# Altium schematic sheet 7 esc.SchDoc
size A4; DocumentNumber: 7; SheetNumber: 9; SheetTotal: 12
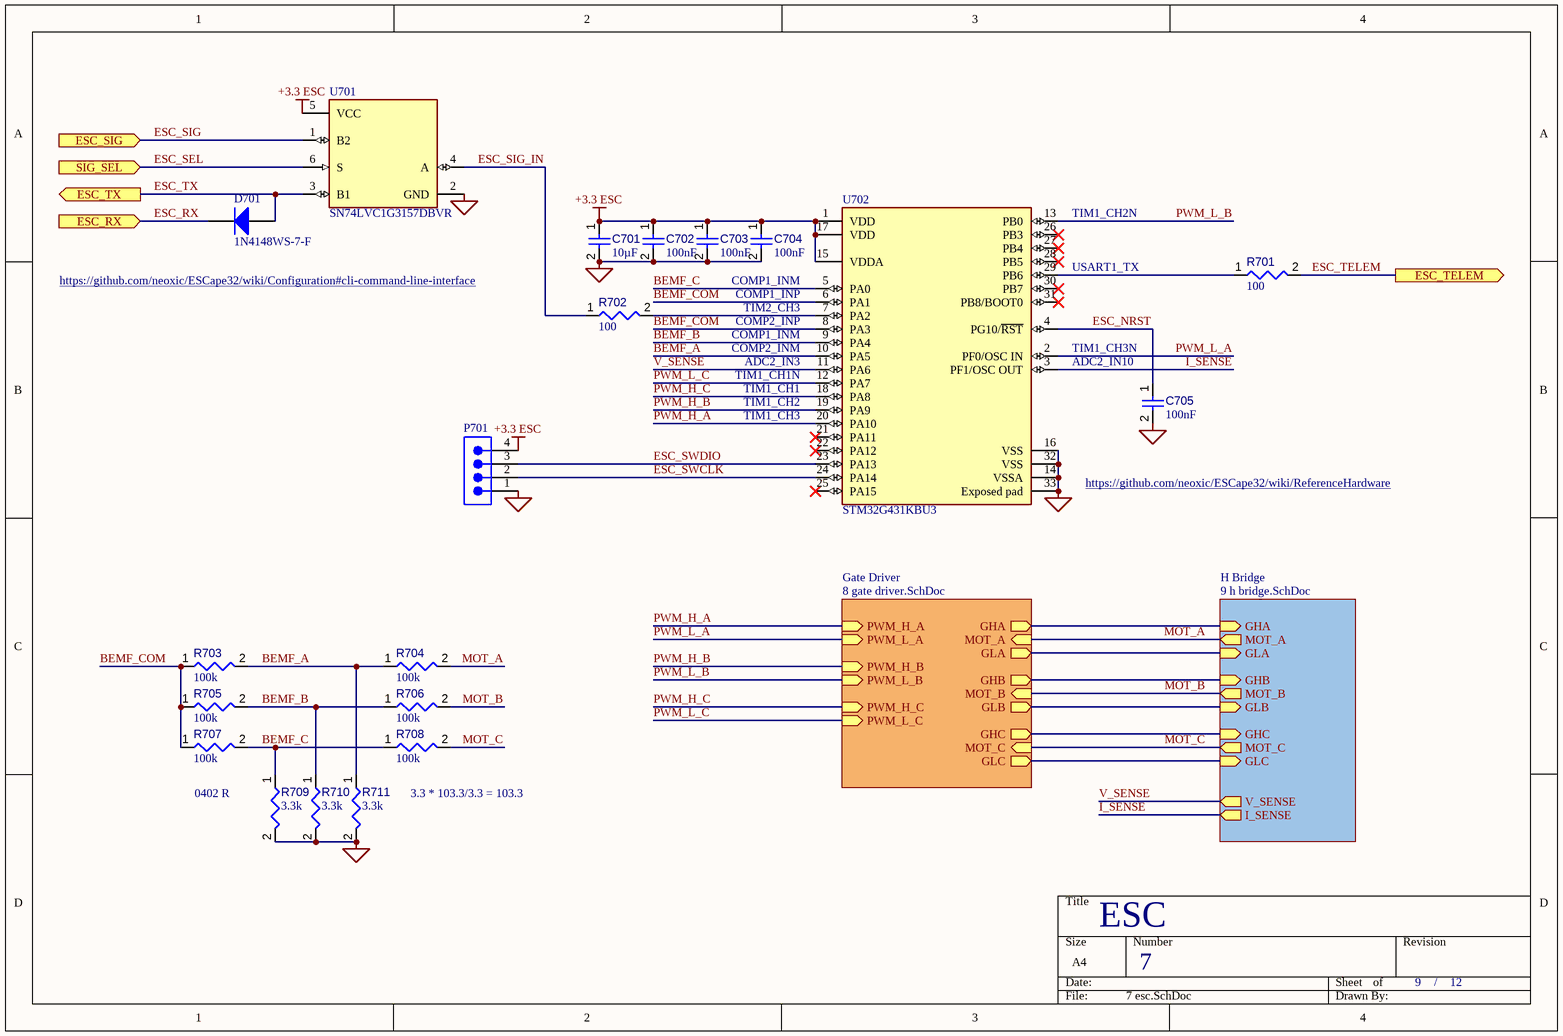
[diagram p0: 7 esc.SchDoc]

## Parts
C701  value 10µF  [CAPC0603(1608)100_L]  (hidden comment: Capacitor 10µF +/-20% 10V 0603)
C702  value 100nF  [CAPC0402(1005)60_L]  (hidden comment: Capacitor 100nF +/-20% 25V 0402)
C703  value 100nF  [CAPC0402(1005)60_L]  (hidden comment: Capacitor 100nF +/-20% 25V 0402)
C704  value 100nF  [CAPC0402(1005)60_L]  (hidden comment: Capacitor 100nF +/-20% 25V 0402)
C705  value 100nF  [CAPC0402(1005)60_L]  (hidden comment: Capacitor 100nF +/-20% 25V 0402)
D701  1N4148WS-7-F  [DIOD-SOD323-2-A_V]
P701  61300411121  [61300411121]  (value not drawn)
R701  value 100  [RESC0402(1005)_L]  (hidden comment: Resistor 100R +/-1 % 0402 63 mW)
R702  value 100  [RESC0402(1005)_L]  (hidden comment: Resistor 100R +/-1 % 0402 63 mW)
R703  value 100k  [RESC0402(1005)_L]  (hidden comment: Resistor 100K +/-1 % 0402 63 mW)
R704  value 100k  [RESC0402(1005)_L]  (hidden comment: Resistor 100K +/-1 % 0402 63 mW)
R705  value 100k  [RESC0402(1005)_L]  (hidden comment: Resistor 100K +/-1 % 0402 63 mW)
R706  value 100k  [RESC0402(1005)_L]  (hidden comment: Resistor 100K +/-1 % 0402 63 mW)
R707  value 100k  [RESC0402(1005)_L]  (hidden comment: Resistor 100K +/-1 % 0402 63 mW)
R708  value 100k  [RESC0402(1005)_L]  (hidden comment: Resistor 100K +/-1 % 0402 63 mW)
R709  value 3.3k  [RESC0402(1005)_L]  (hidden comment: Resistor 3K3 +/-1 % 0402 63 mW)
R710  value 3.3k  [RESC0402(1005)_L]  (hidden comment: Resistor 3K3 +/-1 % 0402 63 mW)
R711  value 3.3k  [RESC0402(1005)_L]  (hidden comment: Resistor 3K3 +/-1 % 0402 63 mW)
U701  SN74LVC1G3157DBVR  [FP-DBV0006A-IPC_C]
U702  STM32G431KBU3  [FP-UFQFPN32-A0B8-MFG]

## Sub-sheets
Gate Driver = 8 gate driver.SchDoc: MOT_A (in), MOT_B (in), MOT_C (in), GHA (out), GLA (out), GHB (out), GLB (out), GHC (out), GLC (out), PWM_H_A (in), PWM_L_A (in), PWM_H_B (in), PWM_H_C (in), PWM_L_B (in), PWM_L_C (in)
H Bridge = 9 h bridge.SchDoc: I_SENSE (out), V_SENSE (out), GHA (in), MOT_A (out), GLA (in), GHB (in), MOT_B (out), GLB (in), GHC (in), MOT_C (out), GLC (in)

## Ports
ESC_RX (in), ESC_SIG (in), ESC_TELEM (out), ESC_TX (out), SIG_SEL (in)

## Nets
+3.3 ESC: C701.1 C702.1 C703.1 C704.1 P701.4 U701.5(VCC) U702.1(VDD) U702.15(VDDA) U702.17(VDD)
PGND: C701.2 C702.2 C703.2 C704.2 C705.2 P701.1 R709.2 R710.2 R711.2 U701.2(GND) U702.14(VSSA) U702.16(VSS) U702.32(VSS) U702.33(Exposed_pad)
BEMF_A: R703.2 R704.1 R711.1 U702.10(PA5)
BEMF_B: R705.2 R706.1 R710.1 U702.9(PA4)
BEMF_C: R707.2 R708.1 R709.1 U702.5(PA0)
BEMF_COM: R703.1 R705.1 R707.1 U702.6(PA1) U702.8(PA3)
ESC_NRST: C705.1 U702.4(PG10/~{RST})
ESC_RX: D701.2(K) ; port ESC_RX
ESC_SEL: U701.6(S) ; port SIG_SEL
ESC_SIG: U701.1(B2) ; port ESC_SIG
ESC_SIG_IN: R702.1 U701.4(A)
ESC_SWCLK: P701.2 U702.24(PA14)
ESC_SWDIO: P701.3 U702.23(PA13)
ESC_TELEM: R701.2 ; port ESC_TELEM
ESC_TX: D701.1(A) U701.3(B1) ; port ESC_TX
I_SENSE: U702.3(PF1/OSC_OUT) ; sheet H Bridge/I_SENSE
MOT_A: R704.2 ; sheet H Bridge/MOT_A, sheet Gate Driver/MOT_A
MOT_B: R706.2 ; sheet H Bridge/MOT_B, sheet Gate Driver/MOT_B
MOT_C: R708.2 ; sheet H Bridge/MOT_C, sheet Gate Driver/MOT_C
PWM_H_A: U702.20(PA10) ; sheet Gate Driver/PWM_H_A
PWM_H_B: U702.19(PA9) ; sheet Gate Driver/PWM_H_B
PWM_H_C: U702.18(PA8) ; sheet Gate Driver/PWM_H_C
PWM_L_A: U702.2(PF0/OSC_IN) ; sheet Gate Driver/PWM_L_A
PWM_L_B: U702.13(PB0) ; sheet Gate Driver/PWM_L_B
PWM_L_C: U702.12(PA7) ; sheet Gate Driver/PWM_L_C
V_SENSE: U702.11(PA6) ; sheet H Bridge/V_SENSE
NetR701_1: R701.1 U702.29(PB6)
NetR702_2: R702.2 U702.7(PA2)
(unnamed): sheet H Bridge/GHA, sheet Gate Driver/GHA
(unnamed): sheet H Bridge/GLA, sheet Gate Driver/GLA
(unnamed): sheet H Bridge/GHB, sheet Gate Driver/GHB
(unnamed): sheet H Bridge/GLB, sheet Gate Driver/GLB
(unnamed): sheet H Bridge/GHC, sheet Gate Driver/GHC
(unnamed): sheet H Bridge/GLC, sheet Gate Driver/GLC

Not connected (* = marked no-connect by the designer): U702 21(PA11)* 22(PA12)* 25(PA15)* 26(PB3)* 27(PB4)* 28(PB5)* 30(PB7)* 31(PB8/BOOT0)*

## Notes on the sheet
- (near U702) TIM1_CH2N
- https://github.com/neoxic/ESCape32/wiki/Configuration#cli-command-line-interface
- COMP1_INM
- COMP1_INP
- TIM2_CH3
- (near U702) USART1_TX
- (near U702) TIM1_CH1N
- (near U702) ADC2_IN3
- (near U702) COMP1_INM
- (near U702) COMP2_INM
- (near U702) COMP2_INP
- TIM1_CH3N
- ADC2_IN10
- (near U702) TIM1_CH1
- (near U702) TIM1_CH2
- (near U702) TIM1_CH3
- https://github.com/neoxic/ESCape32/wiki/ReferenceHardware
- 0402 R
- 3.3 * 103.3/3.3 = 103.3
- ESC
- /

## Library data of the parts
C701 = CMP-001-00075-4: Chip Capacitor, 10µF +/-20%, 10V, 0603, Thickness 1 mm; Tolerance: 10%; Voltage Rating: 10V; Max Operating Temperature: 85°C; Pins: 2; Case/Package: 0603; Mounting Technology: SMT; Min Operating Temperature: -55°C
C702-C705 = CMP-001-00065-4: Chip Capacitor, 100nF +/-20%, 25V, 0402, Thickness 0.6 mm; Tolerance: 10%; Max Operating Temperature: 85°C; Min Operating Temperature: -55°C; Pins: 2; Voltage Rating: 25V; Mounting Technology: SMT; Case/Package: 0402
D701 = CMP-1667-00004-1: Fast Switching Diode, 75 V, 0.3 A, -65 to 150 degC, 2-Pin SOD323, RoHS, Tape and Reel; DatasheetVersion: Rev. 25-2, 03/2016; PackageDescription: 2-Pin Small Outline Diode, Body 1.7 x 1.3 mm; ComponentLink2Description: Datasheet; ComponentLink1URL: http://www.diodes.com/; PackageReference: SOD323-2; ComponentLink2URL: http://www.diodes.com/datasheets/ds30097.pdf; ComponentLink1Description: Manufacturer URL
P701 = CMP-1502-01064-3: NexarPartId: 32855522; Operating Supply Voltage: 250V; Pitch: 2.54mm; Contact Resistance: 20mΩ; Number of Positions: 4; Current Rating: 3A; Connector Type: Male Pin; Gender: Male; Contact Plating: Gold; Height: 8.89mm; Lead Pitch: 2.54mm; Lead Free: Lead Free; Contact Mating Length: 5.9944mm; Number of Rows: 1; Termination: Solder; Packaging: Bulk; REACH SVHC: Unknown; Min Operating Temperature: -40°C; RoHS: Compliant; Number of Contacts: 4; Voltage Rating: 250V; Color: Black; Max Operating Temperature: 105°C; Contact Material: Copper; Mount: Through Hole; Orientation: Vertical; Number of Pins: 4
R701 R702 = CMP-009-00167-3: Chip Resistor, 100 Ohms, +/-1 %, 63 mW, -55 to 155 degC, 0402; Power: 63mW; Tolerance: 1%; Min Operating Temperature: -55°C; Case/Package: 0402; Pins: 2; Max Operating Temperature: 155°C
R703-R708 = CMP-009-00168-3: Chip Resistor, 100 kOhms, +/-1 %, 63 mW, -55 to 155 degC, 0402; Tolerance: 1%; Power: 63mW; Max Operating Temperature: 155°C; Min Operating Temperature: -55°C; Pins: 2; Case/Package: 0402
R709-R711 = CMP-009-00145-3: Chip Resistor, 3.3 kOhms, +/-1 %, 63 mW, -55 to 155 degC, 0402; Tolerance: 1%; Power: 63mW; Case/Package: 0402; Min Operating Temperature: -55°C; Max Operating Temperature: 155°C; Pins: 2
U701 = CMP-0859-00203-4: IC SWITCH SPDT SOT23-6; Number of Outputs: 2; Propagation Delay: 300ps; On-State Resistance: 15R; Nominal Supply Current: 10uA; Number of Inputs: 1; Max Supply Voltage: 5.5V; Supply Type: Single; Low Level Output Current: 128mA; Bandwidth: 300MHz; Turn-Off Delay Time: 3.8ns; Turn-On Delay Time: 5.7ns; Operating Supply Current: 1uA; Min Supply Voltage: 1.65V; Polarity: Non-Inverting; Height: 1.3mm; Number of Bits: 1; Case/Package: SOT-23; REACH SVHC: No SVHC; High Level Output Current: 128mA; Weight: 0.000229oz; Max Supply Current: 10uA; Width: 1.75mm; Radiation Hardening: No; Supply Current: 10uA; Length: 3.05mm; Max Operating Temperature: 125°C; Min Operating Temperature: -40°C; Package Quantity: 3000; Number of Pins: 6; Termination: SMD/SMT; Series: 74LVC; Packaging: Tape and Reel; Lead Free: Lead Free; Contact Plating: Gold; Mount: Surface Mount; RoHS Compliant: Yes; Number of Channels: 1; Throw Configuration: SPDT
U702 = CMP-12105-000119-1: IC MCU 32BIT 128KB FLSH 32UFQFPN; RoHS Compliant: Yes